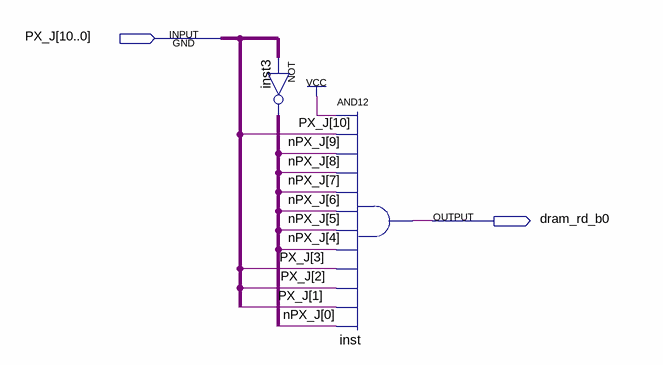
[diagram p0: schematic sheet]
// Quartus schematic dram_rd_b0.bdf as structural Verilog: 2 symbols, 2 pins
module dram_rd_b0 (
  input  [10:0] PX_J,
  output dram_rd_b0
);

  wire [10:0] nPX_J;

  assign nPX_J = ~PX_J;  // NOT inst3, 11 bits wide
  and inst (dram_rd_b0, 1'b1, PX_J[10], nPX_J[9], nPX_J[8], nPX_J[7], nPX_J[6], nPX_J[5], nPX_J[4], PX_J[3], PX_J[2], PX_J[1], nPX_J[0]);
endmodule
